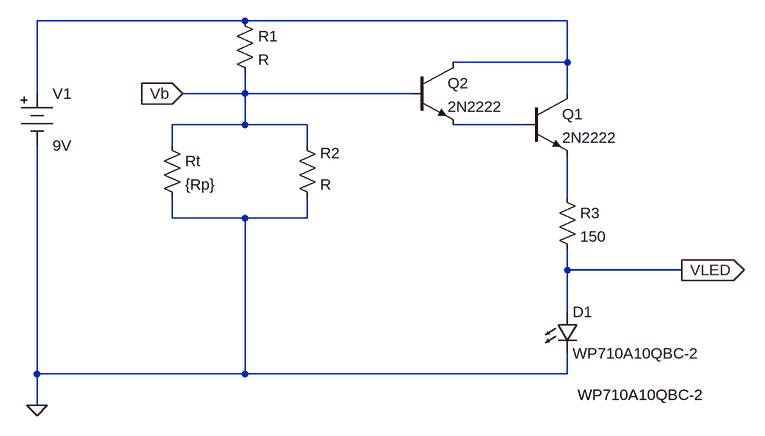
[diagram p0: schematic thermistor.asc]
thermistor.asc, the LTspice schematic file:
Version 4
SHEET 1 1272 792
WIRE 496 176 176 176
WIRE 992 176 496 176
WIRE 992 240 992 176
WIRE 992 240 816 240
WIRE 176 288 176 176
WIRE 496 288 496 256
WIRE 496 288 400 288
WIRE 752 288 496 288
WIRE 992 288 992 240
WIRE 496 336 496 288
WIRE 496 336 384 336
WIRE 592 336 496 336
WIRE 928 336 816 336
WIRE 384 368 384 336
WIRE 592 368 592 336
WIRE 992 448 992 384
WIRE 384 480 384 448
WIRE 496 480 384 480
WIRE 592 480 592 448
WIRE 592 480 496 480
WIRE 992 560 992 528
WIRE 1168 560 992 560
WIRE 992 624 992 560
WIRE 176 720 176 368
WIRE 496 720 496 480
WIRE 496 720 176 720
WIRE 992 720 992 688
WIRE 992 720 496 720
WIRE 176 768 176 720
FLAG 176 768 0
FLAG 400 288 Vb
IOPIN 400 288 In
FLAG 1168 560 VLED
IOPIN 1168 560 Out
SYMBOL Misc/battery 176 272 R0
SYMATTR InstName V1
SYMATTR Value 9V
SYMBOL res 480 160 R0
SYMATTR InstName R1
SYMBOL res 576 352 R0
WINDOW 0 36 28 Left 2
SYMATTR InstName R2
SYMBOL res 976 432 R0
SYMATTR InstName R3
SYMATTR Value 150
SYMBOL npn 928 288 R0
SYMATTR InstName Q1
SYMATTR Value 2N2222
SYMBOL npn 752 240 R0
SYMATTR InstName Q2
SYMATTR Value 2N2222
SYMBOL res 368 352 R0
SYMATTR InstName Rt
SYMATTR Value {Rp}
SYMBOL LED 976 624 R0
SYMATTR InstName D1
SYMATTR Value WP710A10QBC-2
TEXT 1008 752 Left 2 !WP710A10QBC-2

The netlist it stands for:
* thermistor.asc
V1 N001 0 9V
R1 N001 Vb R
R2 Vb 0 R
R3 N003 VLED 150
Q1 N001 N002 N003 0 2N2222
Q2 N001 Vb N002 0 2N2222
Rt Vb 0 {Rp}
D1 VLED 0 WP710A10QBC-2
.model D D
.lib standard.dio
.model NPN NPN
.model PNP PNP
.lib standard.bjt
WP710A10QBC-2
.backanno
.end